# Altium schematic sheet MSP432E401YTPDT MCU.SchDoc
size C
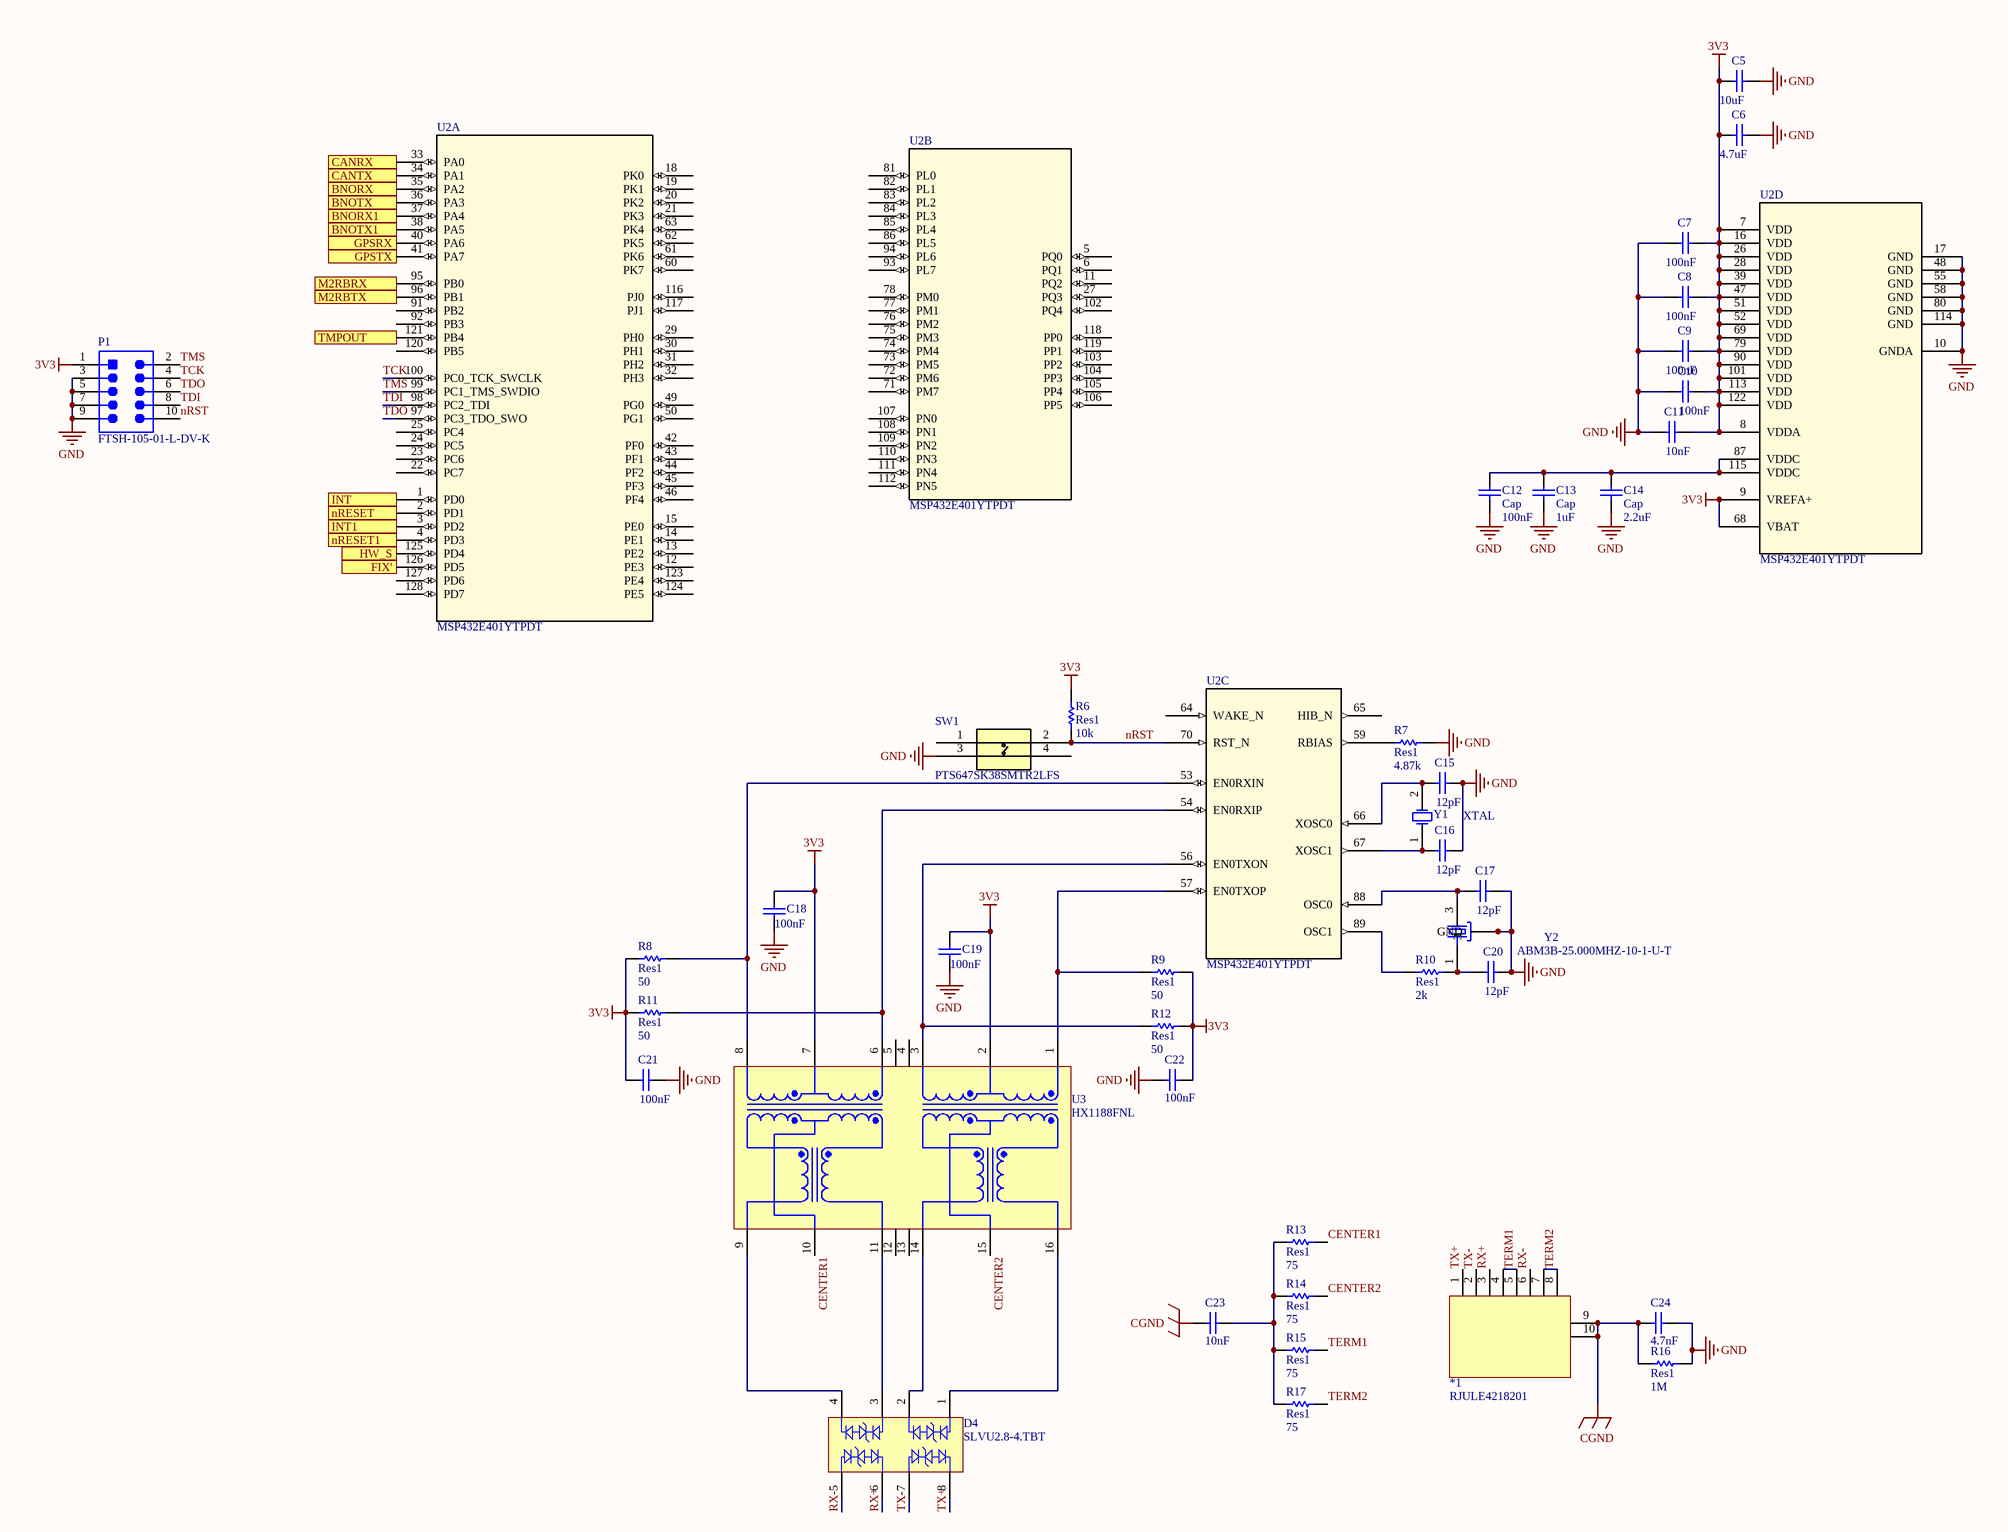
[diagram p0: MSP432E401YTPDT MCU.SchDoc]

## Parts
*1  RJULE4218201  [RJULE4218201]
C5  value 10uF  [6-0805_M]  (hidden comment: Cap)
C6  value 4.7uF  [6-0805_M]  (hidden comment: Cap)
C7  value 100nF  [0402-A]  (hidden comment: Cap)
C8  value 100nF  [0402-A]  (hidden comment: Cap)
C9  value 100nF  [0402-A]  (hidden comment: Cap)
C10  value 100nF  [0402-A]  (hidden comment: Cap)
C11  value 10nF  [0402-A]  (hidden comment: Cap)
C12  Cap  value 100nF  [0402-A]
C13  Cap  value 1uF  [1608[0603]]
C14  Cap  value 2.2uF  [1608[0603]]
C15  value 12pF  [0402-A]  (hidden comment: Cap)
C16  value 12pF  [0402-A]  (hidden comment: Cap)
C17  value 12pF  [0402-A]  (hidden comment: Cap)
C18  value 100nF  [0402-A]  (hidden comment: Cap)
C19  value 100nF  [0402-A]  (hidden comment: Cap)
C20  value 12pF  [0402-A]  (hidden comment: Cap)
C21  value 100nF  [0402-A]  (hidden comment: Cap)
C22  value 100nF  [0402-A]  (hidden comment: Cap)
C23  value 10nF  [0402-A]  (hidden comment: Cap)
C24  value 4.7nF  [C1206]  (hidden comment: Cap)
D4  SLVU2.8-4.TBT  [SEMT-SO-8_V]
P1  FTSH-105-01-L-DV-K  [SMTC-FTSH-105-01-L-DV-K_V]
R6  Res1  value 10k  [0402-A]
R7  Res1  value 4.87k  [0402-A]
R8  Res1  value 50  [0402-A]
R9  Res1  value 50  [0402-A]
R10  Res1  value 2k  [0402-A]
R11  Res1  value 50  [0402-A]
R12  Res1  value 50  [0402-A]
R13  Res1  value 75  [0402-A]
R14  Res1  value 75  [0402-A]
R15  Res1  value 75  [0402-A]
R16  Res1  value 1M  [C1206]
R17  Res1  value 75  [0402-A]
SW1  PTS647SK38SMTR2LFS  [PTS647SK38SMTR2LFS_CNK]
U2  MSP432E401YTPDT  [PDT0128A]  (parts A,B,C,D of 4)
U3  HX1188FNL  [PULS-HX1188FNL-SMT-16_V]
Y1  XTAL  [FC-135 32.7680KA-AC0]
Y2  ABM3B-25.000MHZ-10-1-U-T  [OSCCC500X320X110-4N]

## Ports
BNORX1 (in), BNORX (in), BNOTX1 (out), BNOTX (out), CANRX (in), CANTX (out), FIX' (in), GPSRX (in), GPSTX (out), HW_S (out), INT1 (in), INT (in), M2RBRX (in), M2RBTX (out), nRESET1 (out), nRESET (out), TMPOUT (in)

## Nets
3V3: C5.1 C6.1 C7.2 C8.2 C9.2 C10.2 C11.2 C18.1 C19.1 C21.1 C22.1 P1.1 R6.1 R8.1 R9.1 R11.1 R12.1 U2.7(VDD) U2.8(VDDA) U2.9(VREFA+) U2.16(VDD) U2.26(VDD) U2.28(VDD) U2.39(VDD) U2.47(VDD) U2.51(VDD) U2.52(VDD) U2.68(VBAT) U2.69(VDD) U2.79(VDD) U2.90(VDD) U2.101(VDD) U2.113(VDD) U2.122(VDD) U3.2(TCT) U3.7(RCT)
CGND: *1.9 *1.10 C23.1 C24.1 R16.1
GND: C5.2 C6.2 C7.1 C8.1 C9.1 C10.1 C11.1 C12.1 C13.1 C14.1 C15.1 C16.1 C17.1 C18.2 C19.2 C20.1 C21.2 C22.2 C24.2 P1.3 P1.5 P1.7 P1.9 R7.1 R16.2 SW1.3 U2.10(GNDA) U2.17(GND) U2.48(GND) U2.55(GND) U2.58(GND) U2.80(GND) U2.114(GND) Y2.2(GND) Y2.4(GND)
BNORX: U2.35(PA2) ; port BNORX
BNORX1: U2.37(PA4) ; port BNORX1
BNOTX: U2.36(PA3) ; port BNOTX
BNOTX1: U2.38(PA5) ; port BNOTX1
CANRX: U2.33(PA0) ; port CANRX
CANTX: U2.34(PA1) ; port CANTX
CENTER1: R13.2 U3.10(CMT)
CENTER2: R14.2 U3.15(CMT)
FIX': U2.126(PD5) ; port FIX'
GPSRX: U2.40(PA6) ; port GPSRX
GPSTX: U2.41(PA7) ; port GPSTX
HW_S: U2.125(PD4) ; port HW_S
INT: U2.1(PD0) ; port INT
INT1: U2.3(PD2) ; port INT1
M2RBRX: U2.95(PB0) ; port M2RBRX
M2RBTX: U2.96(PB1) ; port M2RBTX
nRESET: U2.2(PD1) ; port nRESET
nRESET1: U2.4(PD3) ; port nRESET1
nRST: P1.10 R6.2 SW1.2 U2.70(RST_N)
RX+: *1.3 D4.6
RX-: *1.6 D4.5
TCK: P1.4 U2.100(PC0_TCK_SWCLK)
TDI: P1.8 U2.98(PC2_TDI)
TDO: P1.6 U2.97(PC3_TDO_SWO)
TERM1: *1.4 *1.5 R15.2
TERM2: *1.7 *1.8 R17.2
TMPOUT: U2.121(PB4) ; port TMPOUT
TMS: P1.2 U2.99(PC1_TMS_SWDIO)
TX+: *1.1 D4.8
TX-: *1.2 D4.7
NetC12_2: C12.2 C13.2 C14.2 U2.87(VDDC) U2.115(VDDC)
NetC15_2: C15.2 U2.66(XOSC0) Y1.2(OSC2)
NetC16_2: C16.2 U2.67(XOSC1) Y1.1(OSC1)
NetC17_2: C17.2 U2.88(OSC0) Y2.3
NetC20_2: C20.2 R10.2 Y2.1
NetC23_2: C23.2 R13.1 R14.1 R15.1 R17.1
NetD4_1: D4.1 U3.16(TX+)
NetD4_2: D4.2 U3.14(TX-)
NetD4_3: D4.3 U3.11(RX+)
NetD4_4: D4.4 U3.9(RX-)
NetR7_2: R7.2 U2.59(RBIAS)
NetR8_2: R8.2 U2.53(EN0RXIN) U3.8(RD-)
NetR9_2: R9.2 U2.57(EN0TXOP) U3.1(TD+)
NetR10_1: R10.1 U2.89(OSC1)
NetR11_2: R11.2 U2.54(EN0RXIP) U3.6(RD+)
NetR12_2: R12.2 U2.56(EN0TXON) U3.3(TD-)

Not connected (* = marked no-connect by the designer): SW1 1 4; U2 5(PQ0) 6(PQ1) 11(PQ2) 12(PE3) 13(PE2) 14(PE1) 15(PE0) 18(PK0) 19(PK1) 20(PK2) 21(PK3) 22(PC7) 23(PC6) 24(PC5) 25(PC4) 27(PQ3) 29(PH0) 30(PH1) 31(PH2) 32(PH3) 42(PF0) 43(PF1) 44(PF2) 45(PF3) 46(PF4) 49(PG0) 50(PG1) 60(PK7) 61(PK6) 62(PK5) 63(PK4) 64(WAKE_N) 65(HIB_N) 71(PM7) 72(PM6) 73(PM5) 74(PM4) 75(PM3) 76(PM2) 77(PM1) 78(PM0) 81(PL0) 82(PL1) 83(PL2) 84(PL3) 85(PL4) 86(PL5) 91(PB2) 92(PB3) 93(PL7) 94(PL6) 102(PQ4) 103(PP2) 104(PP3) 105(PP4) 106(PP5) 107(PN0) 108(PN1) 109(PN2) 110(PN3) 111(PN4) 112(PN5) 116(PJ0) 117(PJ1) 118(PP0) 119(PP1) 120(PB5) 123(PE4) 124(PE5) 127(PD6) 128(PD7); U3 4(NC) 5(NC) 12(NC) 13(NC)

## Library data of the parts
C5-C24 = Cap: Capacitor; Published: 8-Jun-2000; LatestRevisionDate: 17-Jul-2002; LatestRevisionNote: Re-released for DXP Platform.; PackageReference: RAD-0.3; Publisher: Altium Limited; PackageDescription: Radial Cap, Thru-Hole; 2 Leads; 0.3 in Pin Spacing
D4 = CMP-2000-07074-1: EPD TVS Diode Array for ESD and Latch-Up Protection, 2.8 V VRWM, -55 to 125 degC, 8-Pin SOIC, RoHS, Tape and Reel; Manufacturer: Semtech; Peak Pulse Current: 24A; Working Voltage (Max): 2.8V; Product Length (mm): 5mm; Clamping Voltage: 15V; Configuration: Dual; Number of  Elements: 4; Rad Hardened: No; Product Depth (mm): 4mm; Peak Pulse Power Dissipation: 400W; Direction Type: Bi-Directional; Leakage Current: 1uA; Polarity: Uni-Directional; Product Height (mm): 1.5mm; Datasheet Version: 01/2008; Reverse Stand-off Voltage: 2.8V; Operating Temperature Max Deg. C: 125C; Operating Temperature Classification: Military; Packaging: TapeandReel; Manufacturer URL: http://www.semtech.com/; Operating Temp Range: -55Cto125C; Mounting: SurfaceMount; Package Reference: SO-8; Operating Temperature Min Deg. C: -55C; Mounting Technology: SurfaceMount; Working Voltage: 2.8V; Suppressor Type: TVS; Leakage Current (Max): 1uA; Mounting Style: SurfaceMount; Package Description: 8-Pin Small Outline Integrated Circuit, Body 4.9 x 3.9 mm, Pitch 1.27 mm; Datasheet URL: http://www.semtech.com/images/datasheet/slvu2.8-4.pdf; Pin Count: 8; Clamping Voltage (Max): 15V; Package / Case: SOIC; Package Type: SOIC
P1 = CMP-2000-05353-1: Male Header, Pitch 1.27 mm, 2 x 5 Position, Height 6.25 mm; Manufacturer: Samtec; Pitch: 0.050"(1.27mm); Other Names: Q3937619; Number of Positions: 10; Mating Products: SFMC-105-L2-S-D-TR-ND / -CONN.05"SURFACE10POSSMT / FLE-105-01-G-DV-TR-ND / -CONNSKT1.27MM10POSDUALSMD / FLE-105-01-G-DV-A-P-ND / -CONNSKT1.27MM10POSDUALSMD / FLE-105-01-G-DV-A-ND / -CONNSKT1.27MM10POSDUALSMD / CLP-105-02-G-D-P-TR-ND / -CONNRCPT10POSDUAL.05"SMD / SAM1155-05-ND / -CONNRCPT10POSDUAL.05"SMD / SAM1154-05-ND / -CONNRCPT10POSDUAL.05"SMD / SAM1153-05-ND / -CONNRCPT10POSDUAL.05"SMD / SAM1226-05-ND / -CONNRCPT.05"10POSDUALSMD; Number of Positions Loaded: All; Connector Type: Header,Unshrouded; Product Training Modules: Board-to-BoardConnectors; Datasheet Version: Rev. ET, 10/1995; Number of Rows: 2; Standard Package: 1; Package Description: Male Header, Pitch 1.27 mm, 2 x 5 Position, Height 5.97 mm, Tail Length 4.32 mm; Contact Finish Thickness: 10µin(0.25µm); Series: FTSH; Termination: Solder; Contact Type: MalePin; Color: Black; Package Reference: FTSH-105-01-L-DV-K; Family: RectangularConnectors-Headers,MalePins; Package URL: http://suddendocs.samtec.com/prints/ftsh-1xx-xx-xxx-dv-xxx-footprint.pdf; Packaging: Tube; Mounting Type: SurfaceMount; Category: Connectors,Interconnects; Datasheet URL: http://suddendocs.samtec.com/prints/ftsh-1xx-xx-xxx-dv-xxx-mkt.pdf; Row Spacing: 0.050"(1.27mm); Manufacturer URL: http://www.samtec.com/; Contact Mating Length: 0.120"(3.05mm); Contact Finish: Gold
R6-R17 = Res1: Resistor; Published: 8-Jun-2000; LatestRevisionDate: 17-Jul-2002; LatestRevisionNote: Re-released for DXP Platform.; PackageReference: AXIAL-0.3; Publisher: Altium Limited; PackageDescription: Axial Device, Thru-Hole; 2 Leads; 0.3 in Pin Spacing
SW1 = PTS647SK38SMTR2LFS: No Description Available; Vendor: C&K; Built_By: EMA_Cory; SourceLibrary: C&K_2020-05-06; Datasheet: https://www.ckswitches.com/media/2567/pts647.pdf; Manufacturer_Part_Number: PTS647SK38SMTR2LFS; Copyright: Copyright (C) 2018 Accelerated Designs. All rights reserved; RefDes: RefDes; Type: DEV
U2 = MSP432E401YTPDT: No Description Available; Manufacturer: Texas Instruments; PartNumber: MSP432E401YTPDTR; RefDes: RefDes; Type: DEV; Value: Value; Copyright: Copyright (C) 2018 Accelerated Designs. All rights reserved
U3 = CMP-2000-06431-1: Telecom Transformer 1:1/1:1, -40 to 85 degC, 16-Pin SMT, RoHS, Tube; Manufacturer: Pulse Electronics; Turns Ratio - Primary: Secondary:1:1Transmitter,1:1Receiver; Online Catalog: HX1188; Other Names: 553-2200; Other Related Documents: PackagesFNLvs.NL; Transformer Type: IsolationandDataInterface(Encapsulated); Datasheet Version: Rev. B, 05/2014; Family: PulseTransformers; PartNumber: HX1188FNL; Manufacturer URL: http://www.pulseelectronics.com/; Package Description: 16-Pin Surface Mount Device, Body 12.7 x 9.09 mm, Pitch 1.27 mm; Mounting Type: SurfaceMount; Package Reference: SMT; Mounting Technology: SurfaceMount; Datasheet URL: http://productfinder.pulseeng.com/products/datasheets/HX1188FNL.pdf;jsessionid=D0CB5525A348FF42F5E5BE320CB10324; Height - Seated (Max): 5.99mm; Category: Transformers; Standard Package: 40; Size / Dimension: 12.70mmLx9.00mmW
Y1 = XTAL: Crystal Oscillator; Published: 8-Jun-2000; LatestRevisionDate: 17-Jul-2002; LatestRevisionNote: Re-released for DXP Platform.; PackageReference: R38; Publisher: Altium Limited; PackageDescription: Crystal, Thru-Hole; 2 Leads; Body 3.1 x 8.2 mm (Dia.xH)
Y2 = ABM3B-25.000MHZ-10-1-U-T: 25MHz Â±10ppm Crystal 10pF 50 Ohms 4-SMD, No Lead; MF: Abracon; Value: *; Availability: Unavailable; Package: SMD-4 Abracon; SnapEDA_Link: https://www.snapeda.com/parts/ABM3B-25.000MHZ-10-1-U-T/Abracon%20LLC/view-part/425314/?ref=snap; Price: None; MP: ABM3B-25.000MHZ-10-1-U-T